# EAGLE design working (EAGLE 6.3)
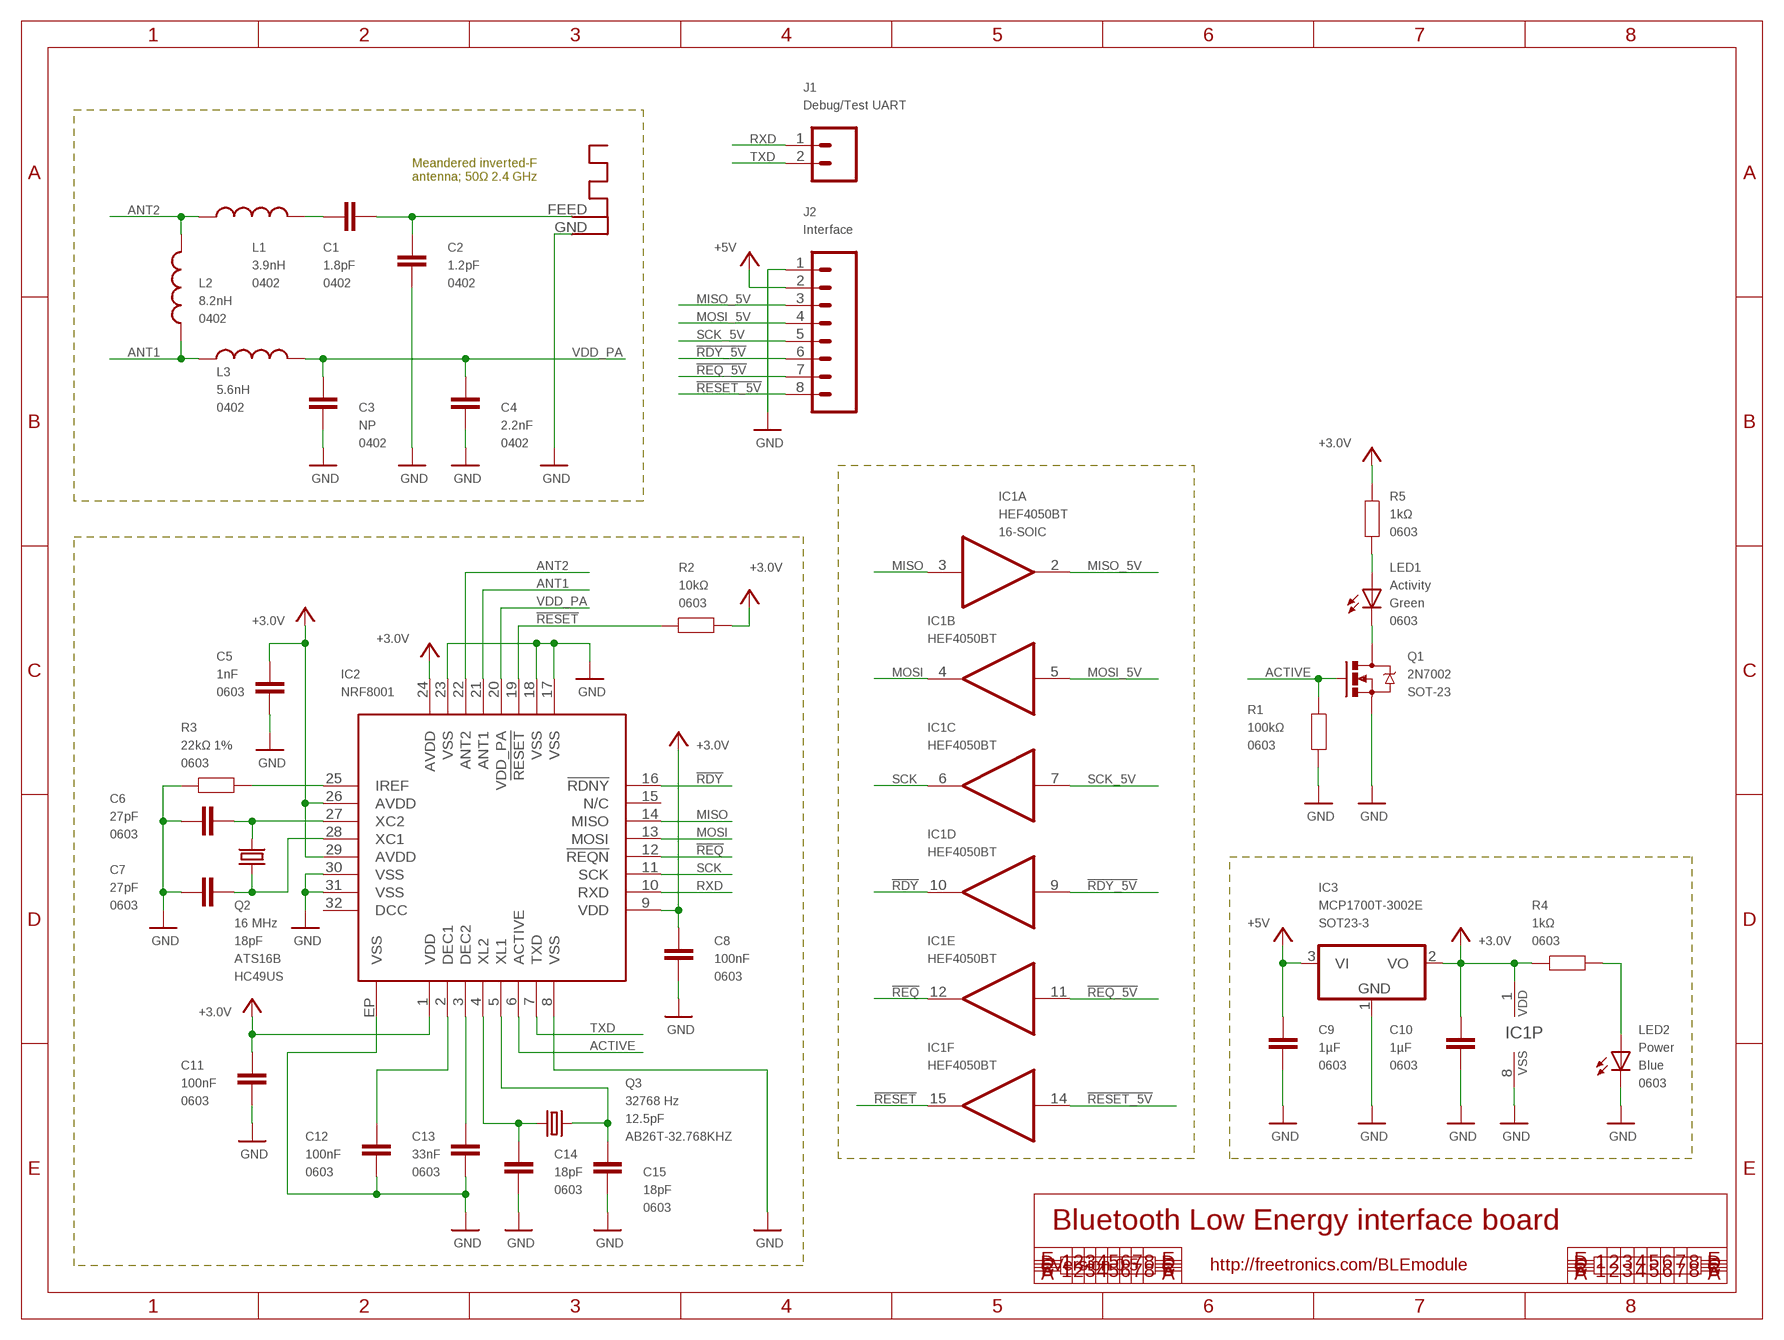
[diagram p0: schematic, sheet 1]

## Parts
ANT1  ANTENNA  [RN-ANT]
C1  1.8pF  CAP0402  [C0402]
C2  1.2pF  CAP0402  [C0402]
C3  NP  CAP0402  [C0402]
C4  2.2nF  CAP0402  [C0402]
C5  1nF  CAP0603  [0603]
C6  27pF  CAP0603  [0603]
C7  27pF  CAP0603  [0603]
C8  100nF  CAP0603  [0603]
C9  1µF  CAP0603  [0603]
C10  1µF  CAP0603  [0603]
C11  100nF  CAP0603  [0603]
C12  100nF  CAP0603  [0603]
C13  33nF  CAP0603  [0603]
C14  18pF  CAP0603  [0603]
C15  18pF  CAP0603  [0603]
IC1  HEF4050BT  4050D  [SO16]
IC2  NRF8001  FITNESSDEVICE_NRF8001  [FITNESSDEVICE_QFN-32]
IC3  MCP1700T-3002E  MCP1703CB  [SOT23]
J1  Debug/Test UART  M02PTH  [1X02]
J2  Interface  M08STD  [1X08]
L1  3.9nH  INDUCTOR0402  [C0402]
L2  8.2nH  INDUCTOR0402  [C0402]
L3  5.6nH  INDUCTOR0402  [C0402]
LED1  Activity  LED0603  [LED-0603]
LED2  Power  LED0603  [LED-0603]
Q1  2N7002  [SOT23-3]
Q2  16 MHz  CRYSTALHC49UV  [HC49U-V]
Q3  32768 Hz  CRYSTALTC26H  [TC26H]
R1  100kΩ  RESISTOR0603  [0603]
R2  10kΩ  RESISTOR0603  [0603]
R3  22kΩ 1%  RESISTOR0603  [0603]
R4  1kΩ  RESISTOR0603  [0603]
R5  1kΩ  RESISTOR0603  [0603]

## Nets
!RDY: IC1.10(D:O) IC2.16(!RDNY)
!RDY_5V: IC1.9(D:I) J2.6
!REQ: IC1.12(E:O) IC2.12(!REQN)
!REQ_5V: IC1.11(E:I) J2.7
!RESET: IC1.15(F:O) IC2.19(!RESET) R2.2
!RESET_5V: IC1.14(F:I) J2.8
+3.0V: C5.2 C8.2 C10.2 C11.2 IC1.1(P:VDD) IC2.1(VDD) IC2.9(VDD) IC2.24(AVDD) IC2.26(AVDD) IC2.29(AVDD) IC3.2(VO) R2.1 R4.2 R5.1
+5V: C9.2 IC3.3(VI) J2.2
ACTIVE: IC2.6(ACTIVE) Q1.1(G) R1.1
ANT1: IC2.21(ANT1) L2.2 L3.1
ANT2: IC2.22(ANT2) L1.2 L2.1
GND: ANT1.GND C2.1 C3.1 C4.1 C5.1 C6.1 C7.1 C8.1 C9.1 C10.1 C11.1 C12.1 C13.1 C14.1 C15.1 IC1.8(P:VSS) IC2.8(VSS) IC2.17(VSS) IC2.18(VSS) IC2.23(VSS) IC2.30(VSS) IC2.31(VSS) IC2.EP(VSS) IC3.1(GND) J2.1 LED2.C Q1.2(S) R1.2 R3.2
MISO: IC1.3(A:I) IC2.14(MISO)
MISO_5V: IC1.2(A:O) J2.3
MOSI: IC1.4(B:O) IC2.13(MOSI)
MOSI_5V: IC1.5(B:I) J2.4
N$1: C12.2 IC2.2(DEC1)
N$2: C13.2 IC2.3(DEC2)
N$3: IC2.25(IREF) R3.1
N$4: C7.2 IC2.28(XC1) Q2.1
N$5: C6.2 IC2.27(XC2) Q2.2
N$6: C14.2 IC2.4(XL2) Q3.1
N$7: C15.2 IC2.5(XL1) Q3.2
N$8: ANT1.FEED C1.1 C2.2
N$13: C1.2 L1.1
N$14: LED2.A R4.1
N$15: LED1.C Q1.3(D)
N$17: LED1.A R5.2
RXD: IC2.10(RXD) J1.1
SCK: IC1.6(C:O) IC2.11(SCK)
SCK_5V: IC1.7(C:I) J2.5
TXD: IC2.7(TXD) J1.2
VDD_PA: C3.2 C4.2 IC2.20(VDD_PA) L3.2
Unconnected: IC2.15(N/C) IC2.32(DCC)

## Notes on the sheet
- Meandered inverted-F
  antenna; 50Ω 2.4 GHz
- Bluetooth Low Energy interface board
- Version 0.5 | http://freetronics.com/BLEmodule

## Library data of the parts
ANT1 = adafruit:ANTENNA
C1-C4 = freetronics-master-v1:CAP: Capacitor Standard 0603 ceramic capacitor, and 0.1" leaded capacitor.; PACKAGE: 0402
C5-C15 = freetronics-master-v1:CAP: Capacitor Standard 0603 ceramic capacitor, and 0.1" leaded capacitor.; PACKAGE: 0603
IC1 = 40xx:4050: Hex non-inverting BUFFER; PACKAGE: 16-SOIC
IC2 = bluetooth:FITNESSDEVICE_NRF8001: nRF8001 is a Bluetooth® low energy solution designed for operation in the peripheral role. By integrating a Bluetooth low energy compliant radio (PHY), slave mode link controller and host, nRF8001 offers you an easy way to add Bluetooth low energy connectivity to your application.; VALUE2: NRF8001
IC3 = linear:MCP1703: 250 mA, 16V, Low Quiescent Current LDO Regulator Source: http://ww1.microchip.com/downloads/en/DeviceDoc/22049b.pdf; PACKAGE: SOT23-3
J1 = freetronics-master-v1:M02: Header 2 Standard 2-pin 0.1" header. Use with straight break away headers (SKU : PRT-00116), right angle break away headers (PRT-00553), swiss pins (PRT-00743), machine pins (PRT-00117), and female headers (PRT-00115). Molex polarized connector foot print use with SKU : PRT-08233 with associated crimp pins and housings.
J2 = freetronics-master-v1:M08: Header 8 Standard 8-pin 0.1" header. Use with straight break away headers (SKU : PRT-00116), right angle break away headers (PRT-00553), swiss pins (PRT-00743), machine pins (PRT-00117), and female headers (PRT-00115).
L1-L3 = freetronics-master-v1:INDUCTOR: Inductors Basic Inductor/Choke - 0603 and 1206. Footprints are not proven and vary greatly between part numbers.; PACKAGE: 0402
LED1 = freetronics-master-v1:LED: LEDs Standard schematic elements and footprints for 5mm, 3mm, 1206, and 0603 sized LEDs. 5mm - Spark Fun Electronics SKU : COM-00529 (and others); COLOUR: Green; PACKAGE: 0603
LED2 = freetronics-master-v1:LED: LEDs Standard schematic elements and footprints for 5mm, 3mm, 1206, and 0603 sized LEDs. 5mm - Spark Fun Electronics SKU : COM-00529 (and others); COLOUR: Blue; PACKAGE: 0603
Q1 = freetronics-luke:2N7002: 2N7002 N-ch MOSFET in SOT-23.; PACKAGE: SOT-23
Q2 = freetronics-master-v1:CRYSTAL: Crystals Various standard crystals. Proven footprints. Spark Fun Electronics SKU : COM-00534; CAPACITANCE: 18pF; ID: ATS16B; PACKAGE: HC49US
Q3 = SparkFun:CRYSTAL: Crystals Various standard crystals. Proven footprints. Spark Fun Electronics SKU : COM-00534; CAPACITANCE: 12.5pF; ID: AB26T-32.768KHZ
R1-R5 = freetronics-master-v1:RESISTOR: Resistor Basic schematic elements and footprints for 0603, 1206, and PTH 1/10th watt (small) resistors.; PACKAGE: 0603

## Board
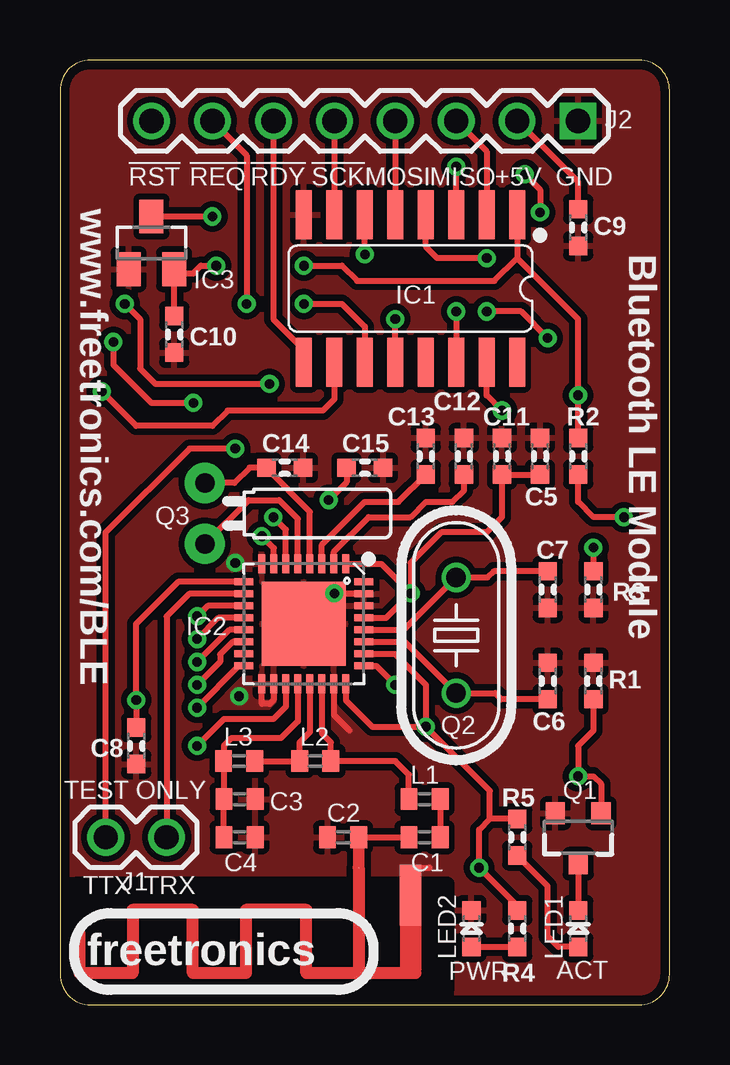
[diagram p1: board, top side]
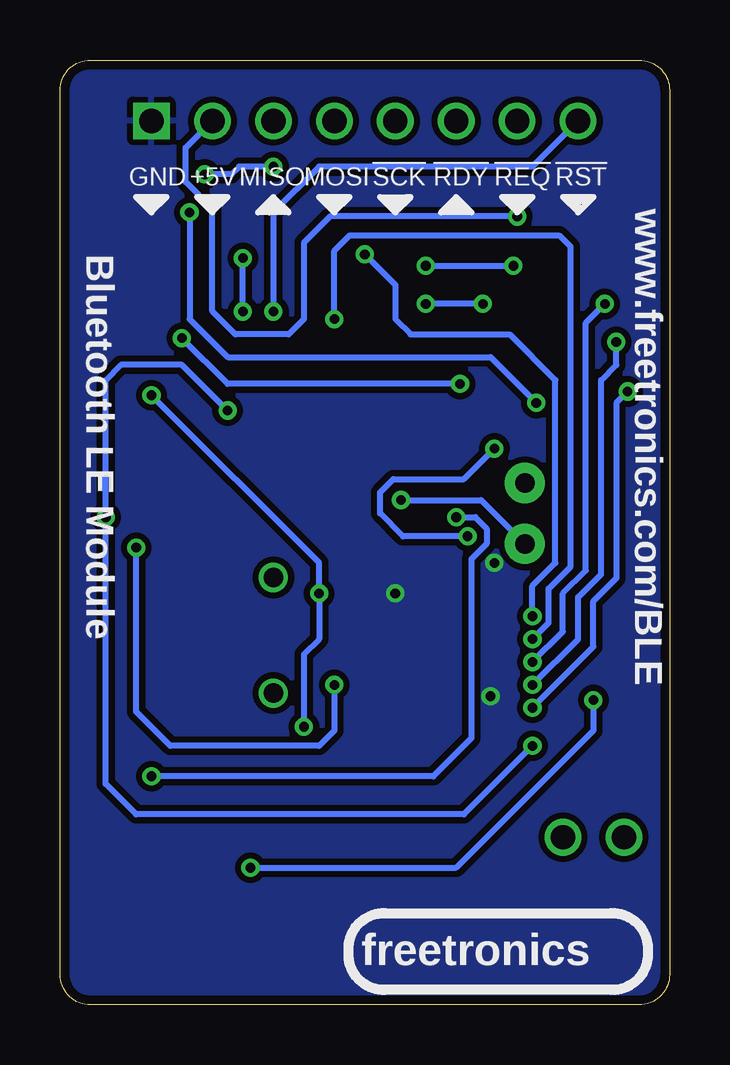
[diagram p2: board, bottom side, seen from below]

Size 25.4 x 39.37 mm. Coordinates in mm from the lower left corner, seen from the top.
Outline: 0,1.27 arc90 1.27,0 24.13,0 arc90 25.4,1.27 25.4,38.1 arc90 24.13,39.37 1.27,39.37 arc90 0,38.1 0,1.27
Copper layers (1*16): Top 0.0356mm / dielectric 1.5011mm / Bottom 0.0356mm
Design rules "LaenPCBOrder *": minimum track width 6mil, minimum drill 13mil, track to track 6mil, track to pad 6mil, pad to pad 6mil, via to via 6mil, smd to smd 6mil, copper to edge 15mil, drill to drill 6mil, minimum pad ring 7mil, minimum via ring 7mil, stop-mask expansion 4mil, vias tented up to drill 16mil, thermal gap 10mil
tRestrict: area 0.6,0.6 to 16.2,5.1

### Footprints (pad centres in the part's own frame; a part is rotated, then mirrored left to right if it is on the bottom)
RN-ANT = smd 0.025 x 0.025: FEED 0,2.159 | smd 2.54 x 0.889: GND -1.143,0
C0402 = smd 0.7 x 0.9: 1 -0.65,0; 2 0.65,0
0603 = smd 0.762 x 0.762: 1 -0.762,0; 2 0.762,0
SO16 = smd 0.66 x 2.032: 1 -4.445,-3.073; 2 -3.175,-3.073; 3 -1.905,-3.073; 4 -0.635,-3.073; 5 0.635,-3.073; 6 1.905,-3.073; 7 3.175,-3.073; 8 4.445,-3.073; 9 4.445,3.073; 10 3.175,3.073; 11 1.905,3.073; 12 0.635,3.073; 13 -0.635,3.073; 14 -1.905,3.073; 15 -3.175,3.073; 16 -4.445,3.073
FITNESSDEVICE_QFN-32 = smd 0.285 x 0.8: 1 -1.75,-2.5; 2 -1.25,-2.5; 3 -0.75,-2.5; 4 -0.25,-2.5; 5 0.25,-2.5; 6 0.75,-2.5; 7 1.25,-2.5; 8 1.75,-2.5; 17 1.75,2.5; 18 1.25,2.5; 19 0.75,2.5; 20 0.25,2.5; 21 -0.25,2.5; 22 -0.75,2.5; 23 -1.25,2.5; 24 -1.75,2.5 | smd 0.8 x 0.285: 9 2.5,-1.75; 10 2.5,-1.25; 11 2.5,-0.75; 12 2.5,-0.25; 13 2.5,0.25; 14 2.5,0.75; 15 2.5,1.25; 16 2.5,1.75; 25 -2.5,1.75; 26 -2.5,1.25; 27 -2.5,0.75; 28 -2.5,0.25; 29 -2.5,-0.25; 30 -2.5,-0.75; 31 -2.5,-1.25; 32 -2.5,-1.75 | smd 3.5 x 3.5: EP 0,0
SOT23 = smd 1 x 1.4: 1 -0.95,-1.1; 2 0.95,-1.1; 3 0,1.1
1X02 = drill 1.016: 1 0,0; 2 2.54,0
1X08 = drill 1.016 square: 1 0,0 | drill 1.016: 2 2.54,0; 3 5.08,0; 4 7.62,0; 5 10.16,0; 6 12.7,0; 7 15.24,0; 8 17.78,0
LED-0603 = smd 0.762 x 0.762: A -0.762,0; C 0.762,0
SOT23-3 = smd 0.8 x 0.9: 1 -0.95,-1; 2 0.95,-1; 3 0,1.1
HC49U-V = drill 0.813: 1 -2.413,0; 2 2.413,0
TC26H = drill 0.813 pad 1.676: 1 -1.27,0; 2 1.27,0

### Placement (x,y rotation side)
ANT1  14.61,5.71 90 top
C1  15.19,6.99 0 top
C2  11.8,6.99 0 top
C3  7.48,8.57 180 top
C4  7.48,6.99 180 top
C5  20,22.86 270 top
C6  20.32,13.49 270 top
C7  20.32,17.3 90 top
C8  3.17,10.79 90 top
C9  21.59,32.39 90 top
C10  4.76,27.94 90 top
C11  18.41,22.86 270 top
C12  16.83,22.86 270 top
C13  15.24,22.86 270 top
C14  9.37,22.38 180 top
C15  12.7,22.38 180 top
IC1  14.61,29.84 180 top
IC2  10.16,15.88 180 top
IC3  3.81,31.75 0 top
J1  4.45,6.99 180 top
J2  21.59,36.83 180 top
L1  15.19,8.57 180 top
L2  10.64,10.16 180 top
L3  7.46,10.16 180 top
LED1  21.59,3.17 90 top
LED2  17.14,3.17 90 top
Q1  21.59,6.99 180 top
Q2  16.51,15.4 270 top
Q3  6.03,20.48 270 top
R1  22.22,13.49 90 top
R2  21.59,22.86 270 top
R3  22.22,17.3 270 top
R4  19.05,3.17 90 top
R5  19.05,6.99 270 top

### Tracks (layer width: path | path; a pad name or v marks a point on that pad's centre or on a via)
!RDY  (via drill 0.4 pad 0.61)
  Top 0.254: IC2.16 7.46,14.12 v5.71,12.38 | IC1.10 11.43,25.24 10.95,24.76 6.99,24.76 6.35,24.13 3.17,24.13 v1.75,25.56
  Bottom 0.254: v5.71,12.38 3.17,14.92 3.17,16.83 2.22,17.78 2.22,25.08 v1.75,25.56
!RDY_5V
  Top 0.254: J2.6 8.89,28.57 10.16,27.3
  Top 0.406: 10.16,27.3 IC1.9
!REQ  (via drill 0.4 pad 0.61)
  Top 0.254: IC2.12 6.6,16.12 v5.71,15.24 | IC1.12 v13.97,28.57
  Bottom 0.254: v5.71,15.24 5.04,15.92 5.04,17.34 4.13,18.26 4.13,31.59 4.6,32.07 13.34,32.07 13.97,31.43 v13.97,28.57
!REQ_5V  (via drill 0.4)
  Top 0.254: J2.7 7.78,35.4 v7.78,29.21 | v10.16,29.21 11.75,29.21 12.7,28.26 IC1.11
  Bottom 0.254: v7.78,29.21 v10.16,29.21
!RESET  (via drill 0.4 pad 0.61)
  Top 0.254: IC2.19 9.41,12.43 8.89,11.91 6.83,11.91 v5.71,10.79 | 17.78,26.04 IC1.15 17.78,25.4 v18.41,24.76 | 21.59,22.07 R2.2 21.59,20.95 22.22,20.32 v23.49,20.32
  Bottom 0.254: v5.71,10.79 8.57,7.94 22.22,7.94 23.49,9.21 v23.49,20.32 23.49,26.04 22.86,26.67 20.32,26.67 v18.41,24.76
!RESET_5V  (via drill 0.4)
  Top 0.254: v16.51,28.89 IC1.14
  Bottom 0.254: v16.51,28.89 16.51,33.02 14.61,34.93 5.71,34.93 J2.8
+3.0V  (via drill 0.4 pad 0.61)
  Top 0.254: C10.2 IC3.2 4.93,30.48 5.56,30.48 5.87,30.8 v6.51,30.8 | IC1.1 19.05,31.11 | IC2.24 11.91,12.7 13.02,11.59 v15.24,11.59 | R4.2 19.05,4.13 v17.46,5.71 17.46,7.3 17.91,7.75 | 19.05,31.11 18.1,30.16 12.38,30.16 11.75,30.8 v10.16,30.8 | IC2.9 4.92,17.62 3.17,15.88 v3.17,12.7 C8.2 | IC2.26 13.95,14.62 15.24,13.34 v15.24,11.59 | IC2.29 13.59,16.12 v14.61,17.14 | C5.2 C11.2 18.41,20.32 17.78,19.68 15.88,19.68 14.61,18.41 v14.61,17.14 | v15.24,11.59 17.91,8.92 17.91,7.75 | IC2.1 13.38,18.38 v14.61,17.14 | R2.1 v21.59,25.4 21.59,28.57 19.05,31.11 | R5.1 17.91,7.75
  Top 0.406: IC3.2
  Bottom 0.254: v10.16,30.8 v6.51,30.8 | v21.59,25.4 14.61,18.41 v14.61,17.14 14.61,15.24 15.24,14.61 v15.24,11.59 | v17.46,5.71 8.89,5.71 3.17,11.43 v3.17,12.7
+5V  (via drill 0.4)
  Top 0.254: IC3.3 v6.35,32.85 | J2.2 21.59,34.29 C9.2
  Bottom 0.254: v6.35,32.85 14.14,32.85 15.24,31.75 15.24,28.57 15.88,27.94 18.1,27.94 19.05,28.89 19.05,33.18 20.16,34.29 20.16,35.72 J2.2
ACTIVE  (via drill 0.4 pad 0.61)
  Top 0.254: IC2.6 9.41,19.8 v8.89,20.32 | Q1.1 22.54,9.21 22.22,9.53 v21.59,9.53 21.59,10.79 22.22,11.43 R1.1
  Bottom 0.254: v8.89,20.32 8.1,20.32 7.62,19.84 7.62,19.21 8.26,18.57 8.26,11.11 9.84,9.53 v21.59,9.53
ANT1
  Top 0.254: IC2.21 10.41,11.36 9.99,10.94 L2.2 L3.1
ANT2
  Top 0.254: IC2.22 10.91,11.31 11.29,10.94 L2.1 13.97,10.16 14.54,9.59 L1.2
GND  (via drill 0.4 pad 0.61)
  Top 0.254: ANT1.GND 14.73,4.57 14.61,4.6 14.61,4.92 | 14.61,4.92 14.61,5.56 14.76,5.71 15.4,5.71 | 14.61,4.92 14.76,4.92 | IC2.18 8.91,12.72 8.73,12.54 8.41,12.54 8.41,13.34 | IC2.23 11.41,12.09 12.06,11.43 | IC2.31 11.45,17.12 v11.43,17.14 IC2.EP
  other vias: 7.46,12.86 7.3,18.41
  pour Top (isolate 0.254): -0.64,40.01 26.04,40.01 26.04,-0.64 -0.64,-0.64
  pour Bottom (isolate 0.254): -0.64,40.01 26.04,40.01 26.04,-0.64 -0.64,-0.64
MISO  (via drill 0.4 pad 0.61)
  Top 0.254: IC2.14 7.19,15.12 6.67,14.61 6.67,14.29 v5.71,13.34 | v2.22,27.62 2.22,26.67 3.81,25.08 v5.56,25.08 | IC1.3 v16.51,34.93 | v19.37,34.61 20,33.97 v20,33.02
  Bottom 0.254: v5.71,13.34 3.81,15.24 3.81,16.99 2.86,17.94 2.86,26.04 2.22,26.67 v2.22,27.62 | v16.51,34.93 17.94,34.93 18.26,34.61 v19.37,34.61 | v20,33.02 20,28.57 18.41,26.99 7.46,26.99 v5.56,25.08
MISO_5V
  Top 0.254: J2.3 17.78,35.56 IC1.2
MOSI  (via drill 0.4 pad 0.61)
  Top 0.254: IC2.13 7.05,15.63 v5.71,14.29 | v2.7,29.21 3.33,28.57 3.33,26.51 3.97,25.88 v8.73,25.88 | v20.32,27.78 19.21,28.89 v17.78,28.89 | v17.78,31.11 15.72,31.11 15.24,31.59 IC1.4
  Bottom 0.254: v5.71,14.29 4.45,15.56 4.45,17.14 3.49,18.1 3.49,28.42 v2.7,29.21 | v17.78,28.89 v17.78,31.11 | v8.73,25.88 18.41,25.88 v20.32,27.78
MOSI_5V
  Top 0.254: J2.4 IC1.5
N$1
  Top 0.254: IC2.2 11.41,18.87 12.86,20.32 14.61,20.32 15.24,20.95 16.35,20.95 16.83,21.43 C12.2
N$2
  Top 0.254: IC2.3 10.91,19.16 12.7,20.95 14.1,20.95 C13.2
N$3  (via drill 0.4 pad 0.61)
  Top 0.254: IC2.25 13.18,14.12 v13.97,13.34 | v22.22,19.05 R3.1
  Bottom 0.254: v22.22,19.05 22.22,12.22 20.8,10.79 14.61,10.79 13.97,11.43 v13.97,13.34
N$4
  Top 0.254: IC2.28 14.32,15.63 Q2.1 17.81,17.81 18.07,18.07 C7.2
N$5
  Top 0.254: IC2.27 14.37,15.12 Q2.2 18.13,12.99 18.38,12.73 C6.2
N$6
  Top 0.254: Q3.1 7.26,21.75 7.9,22.38 C14.2 8.6,22.35 10.41,20.55 IC2.4
N$7  (via drill 0.4)
  Top 0.254: C15.2 11.94,21.78 v11.19,21.03 | IC2.5 9.91,20.25 9.13,21.03 7.86,21.03 Q3.2
  Bottom 0.254: v11.19,21.03 7.86,21.03 Q3.2
N$8
  Top 0.254: ANT1.FEED | C2.2 C1.1
  Top 0.483: C2.2 ANT1.FEED
N$13
  Top 0.254: L1.1 C1.2
N$14
  Top 0.254: LED2.A R4.1
N$15
  Top 0.254: Q1.3 LED1.C
N$17
  Top 0.254: LED1.A 20.76,2.41 20.32,2.86 20.32,4.95 R5.2
RXD
  Top 0.254: IC2.10 5.38,17.12 4.45,16.19 J1.1
SCK  (via drill 0.4 pad 0.61)
  Top 0.254: IC2.11 6.15,16.62 v5.71,16.19 | v12.7,31.27 IC1.6
  Bottom 0.254: v5.71,16.19 5.71,17.46 4.76,18.41 4.76,26.04 6.67,27.94 10.79,27.94 11.43,28.57 11.43,30 v12.7,31.27
SCK_5V
  Top 0.254: J2.5 IC1.7
TXD  (via drill 0.4 pad 0.61)
  Top 0.254: IC2.7 8.91,19.03 v8.41,19.53 | v7.3,23.18 5.4,23.18 1.91,19.68 J1.2
  Bottom 0.254: v8.41,19.53 11.11,19.53 12.06,20.48 12.06,21.35 11.51,21.91 8.57,21.91 v7.3,23.18
VDD_PA
  Top 0.254: IC2.20 9.91,11.81 9.21,11.11 7.14,11.11 6.83,10.79 6.83,10.18 | 6.83,10.18 L3.2 | 6.83,10.18 C3.2 C4.2

### Text on the board
tPlace: !RST | !REQ | !RDY | !SCK | MOSI | MISO | +5V | GND | www.freetronics.com/BLE | Bluetooth LE Module | TEST ONLY | TTX | TRX | freetronics | PWR | ACT
bPlace: !RST | !REQ | !RDY | !SCK | MOSI | MISO | +5V | GND | www.freetronics.com/BLE | Bluetooth LE Module | freetronics